# Altium schematic sheet MicrocontrollerControl.SchDoc: MICROCONTROLLER - CONTROL
size A4; Author: MOG; CompanyName: GIE GROUP; DrawnBy: MOG; Organization: Gie SA; Address1: Galicia 52; Address2: Mar del Plata; Address3: Buenos Aires; Address4: Argentina; DocumentNumber: 10; Revision: 0.0; SheetNumber: 12; SheetTotal: 14; Project: CP DATALOGGER; PageSetup: Record=PageOptions|CenterHorizontal=True|CenterVertical=True|PrintScale=0.94|XCorrection=1.00|YCorrection=1.00|PrintKind=0|BorderSize=5000000|LeftOffset=0|BottomOffset=0|Orientation=2|PaperLength=1000|PaperWidth=1000|Scale=100|PaperSource=7|PrintQuality=720|MediaType=1|DitherType=10|PaperKind=A4|PrintScaleMode=1
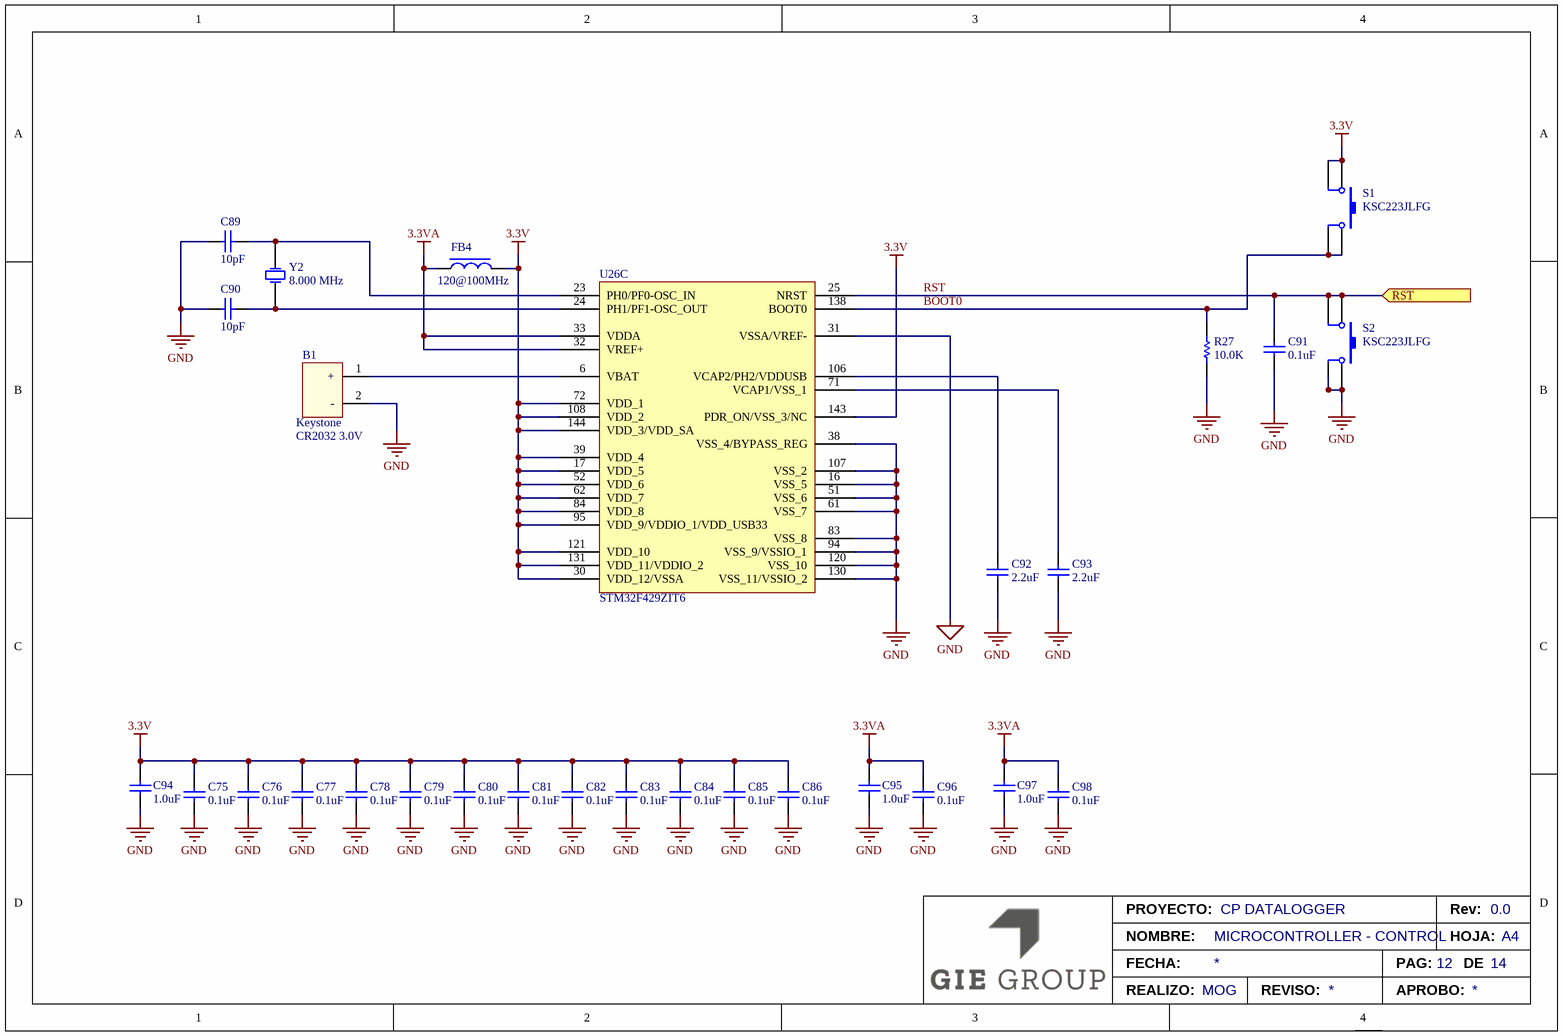
[diagram p0: MicrocontrollerControl.SchDoc]

## Parts
B1  Manufacturer: Keystone  Batery: CR2032 3.0V  [Holder-CR2032-103]  (hidden comment: 101)
C75  value 0.1uF  [CAP-0603]  (hidden comment: C0603C104K5RACAUTO)
C76  value 0.1uF  [CAP-0603]  (hidden comment: C0603C104K5RACAUTO)
C77  value 0.1uF  [CAP-0603]  (hidden comment: C0603C104K5RACAUTO)
C78  value 0.1uF  [CAP-0603]  (hidden comment: C0603C104K5RACAUTO)
C79  value 0.1uF  [CAP-0603]  (hidden comment: C0603C104K5RACAUTO)
C80  value 0.1uF  [CAP-0603]  (hidden comment: C0603C104K5RACAUTO)
C81  value 0.1uF  [CAP-0603]  (hidden comment: C0603C104K5RACAUTO)
C82  value 0.1uF  [CAP-0603]  (hidden comment: C0603C104K5RACAUTO)
C83  value 0.1uF  [CAP-0603]  (hidden comment: C0603C104K5RACAUTO)
C84  value 0.1uF  [CAP-0603]  (hidden comment: C0603C104K5RACAUTO)
C85  value 0.1uF  [CAP-0603]  (hidden comment: C0603C104K5RACAUTO)
C86  value 0.1uF  [CAP-0603]  (hidden comment: C0603C104K5RACAUTO)
C89  value 10pF  [CAP-0603]  (hidden comment: C0603C100K3GAC7867)
C90  value 10pF  [CAP-0603]  (hidden comment: C0603C100K3GAC7867)
C91  value 0.1uF  [CAP-0603]  (hidden comment: C0603C104K5RACAUTO)
C92  value 2.2uF  [CAP-0603]  (hidden comment: C0603C225M9PAC7867)
C93  value 2.2uF  [CAP-0603]  (hidden comment: C0603C225M9PAC7867)
C94  value 1.0uF  [CAP-0603]  (hidden comment: C0603C105M3RAC7867)
C95  value 1.0uF  [CAP-0603]  (hidden comment: C0603C105M3RAC7867)
C96  value 0.1uF  [CAP-0603]  (hidden comment: C0603C104K5RACAUTO)
C97  value 1.0uF  [CAP-0603]  (hidden comment: C0603C105M3RAC7867)
C98  value 0.1uF  [CAP-0603]  (hidden comment: C0603C104K5RACAUTO)
FB4  value 120@100MHz  [IND-0603]  (hidden comment: Z0603C121GPWZT)
R27  value 10.0K  [RES-0603]  (hidden comment: RC0603FR-0710KL)
S1  KSC223JLFG  [KSC_J]
S2  KSC223JLFG  [KSC_J]
U26  STM32F429ZIT6  [LQFP144]  (part C of 3)
Y2  value 8.000 MHz  [XTAL-ABM7]  (hidden comment: ABM7-16.000MHZ-D-2-Y-T)

## Ports
RST (in)

## Nets
3.3V: C75.2 C76.2 C77.2 C78.2 C79.2 C80.2 C81.2 C82.2 C83.2 C84.2 C85.2 C86.2 C94.2 FB4.2 S1.1 S1.4 U26.17(VDD_5) U26.30(VDD_12/VSSA) U26.39(VDD_4) U26.52(VDD_6) U26.62(VDD_7) U26.72(VDD_1) U26.84(VDD_8) U26.95(VDD_9/VDDIO_1/VDD_USB33) U26.108(VDD_2) U26.121(VDD_10) U26.131(VDD_11/VDDIO_2) U26.143(PDR_ON/VSS_3/NC) U26.144(VDD_3/VDD_SA)
3.3VA: C95.2 C96.2 C97.2 C98.2 FB4.1 U26.32(VREF+) U26.33(VDDA)
GND: B1.2(-) C75.1 C76.1 C77.1 C78.1 C79.1 C80.1 C81.1 C82.1 C83.1 C84.1 C85.1 C86.1 C89.1 C90.1 C91.1 C92.1 C93.1 C94.1 C95.1 C96.1 C97.1 C98.1 R27.1 S2.2 S2.3 U26.16(VSS_5) U26.31(VSSA/VREF-) U26.38(VSS_4/BYPASS_REG) U26.51(VSS_6) U26.61(VSS_7) U26.83(VSS_8) U26.94(VSS_9/VSSIO_1) U26.107(VSS_2) U26.120(VSS_10) U26.130(VSS_11/VSSIO_2)
BOOT0: R27.2 S1.2 S1.3 U26.138(BOOT0)
RST: C91.2 S2.1 S2.4 U26.25(NRST) ; port RST
NetB1_1: B1.1(+) U26.6(VBAT)
NetC89_2: C89.2 U26.23(PH0/PF0-OSC_IN) Y2.2(OSC2)
NetC90_2: C90.2 U26.24(PH1/PF1-OSC_OUT) Y2.1(OSC1)
NetC92_2: C92.2 U26.106(VCAP2/PH2/VDDUSB)
NetC93_2: C93.2 U26.71(VCAP1/VSS_1)

## Notes on the sheet
- PROYECTO:
- Rev:
- NOMBRE:
- FECHA:
- REALIZO:
- REVISO:
- APROBO:
- PAG:
- HOJA:
- DE
- A4

## Library data of the parts
B1 = Holder 101: HOLDER BATTERY COIN 20MM TH; PartNumber: 101; Supplier 1: Digi-Key; Supplier Part Number 1: 36-101-ND; Supplier 2: Mouser; Supplier Part Number 2: 534-101
C75-C86 C91 C96 C98 = C0603C104K5RACAUTO: CAP CER 0.1uF 50V X7R 0603; Manufacturer: Kemet; Tolerance: 10%; Voltage: 50; PartNumber: C0603C104K5RACAUTO; Supplier 1: Digi-Key; Supplier 2: Mouser; Supplier Part Number 1: 399-6856-1-ND; Supplier Part Number 2: 80-C0603C104K5RAUTO
C89 C90 = C0603C100K3GAC7867: CAP CER 10 pF 25V C0G 0603; Manufacturer: Kemet; Tolerance: 10%; PartNumber: C0603C100K3GAC7867; Voltage: 25V
C92 C93 = C0603C225M9PAC7867: CAP CER 2.2uF 6.3V X5R 0603; Manufacturer: Kemet; Tolerance: 20%; Voltage: 6.3; PartNumber: C0603C225M9PAC7867
C94 C95 C97 = C0603C105M3RAC7867: CAP CER 1uF 25V X7R 0603; Manufacturer: Kemet; Tolerance: 20%; Voltage: 25; PartNumber: C0603C105M3RAC7867; Supplier 1: Digi-Key; Supplier 2: Mouser; Supplier Part Number 1: 399-C0603C105M3RAC7867CT-ND; Supplier Part Number 2: 80-C0603C105M3R
FB4 = Z0603C121GPWZT: Ferrite Bead 120Ohms 900mA 25% DCR=130m; Manufacturer: Kemet; PartNumber: Z0603C121GPWZT; Supplier 1: Digi-Key; Supplier 2: Mouser; Supplier Part Number 1: 399-Z0603C121GPWZTCT-ND; Supplier Part Number 2: 80-Z0603C121GPWZT
R27 = RC0603FR-0710KL: RES SMD 10.0K OHM 1% 1/10W 0603; Manufacturer: Yageo; Power: 0.1W; Tolerance: 1%; PartNumber: RC0603FR-0710KL; Supplier 1: Digi-Key; Supplier Part Number 1: 311-100KCRCT-ND; Supplier 2: Mouser; Supplier Part Number 2: 603-RC0805FR-07100KL
S1 S2 = KSC223JLFG: SWITCH TACTILE SPST-NO 0.01A 32V; Manufacturer: C&K; Part Number: KSC223JLFG; Supplier 1: Digi-Key; Supplier Part Number 1: CKN12117CT-ND; Supplier 2: Mouser; Supplier Part Number 2: 611-KSC223JLFG
U26 = STM32F429ZIT6: IC MCU 32BIT 2MB FLASH 144LQFP; Manufacturer: STMicroelectronics; PartNumber: STM32F429ZIT6
Y2 = ABM7-8.000MHZ-D2Y-T: CRYSTAL 8.0000 MHZ 18PF SMD; Manufacturer: Abracon; PartNumber: ABM7-16.000MHZ-D-2-Y-T